# EAGLE design MyRIO_Breakout_Gamma2c (EAGLE 9.4.2)

## Sheet 1 of 2
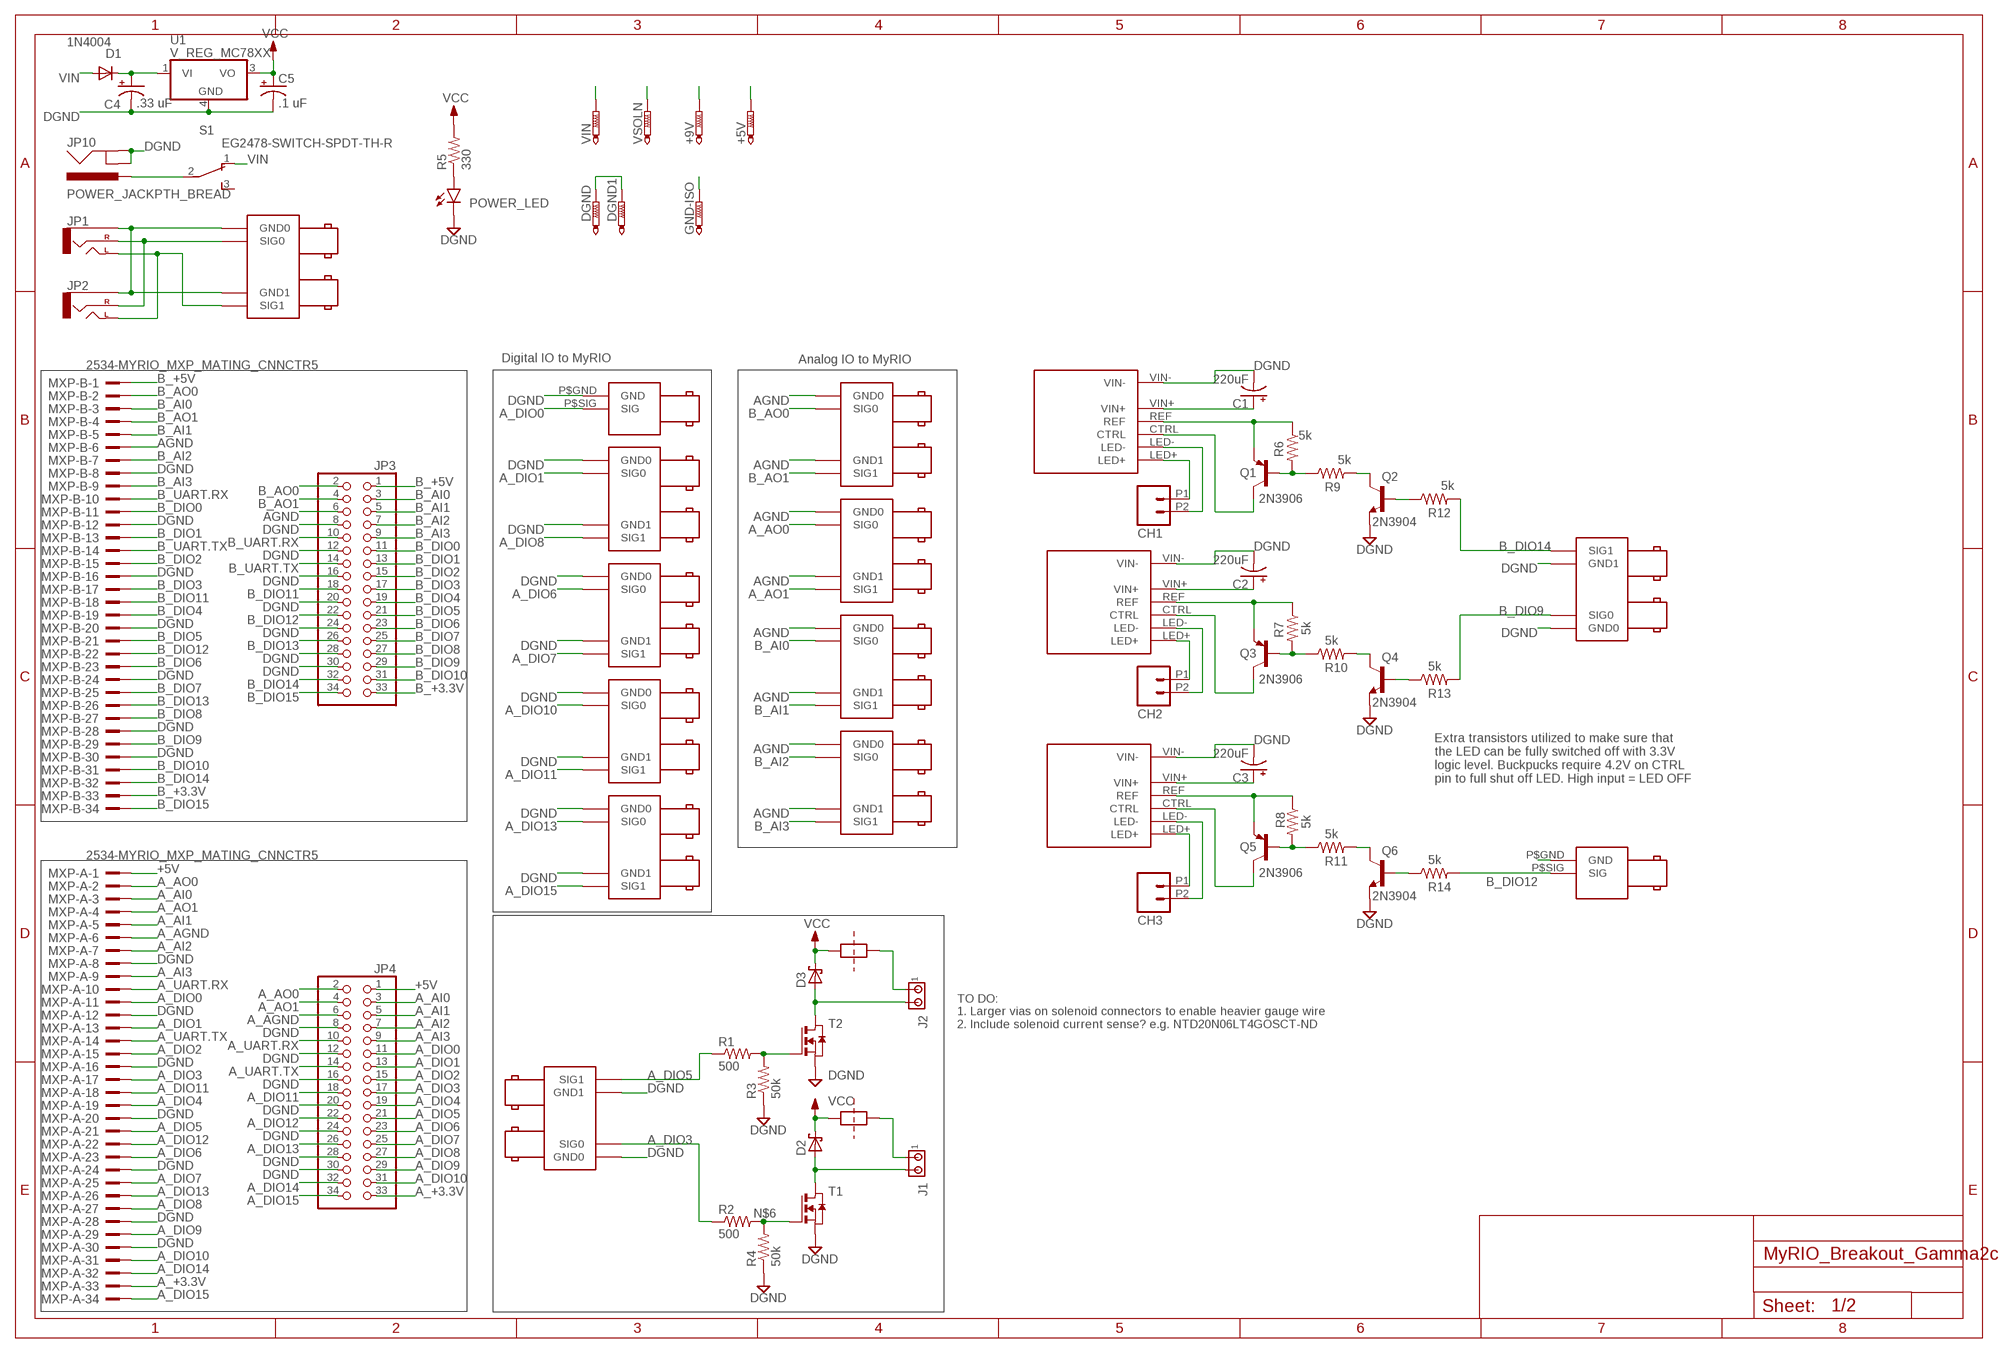
[diagram p0: schematic, sheet 1]

### Parts
+5V  PTR1PAD1-13Y  [P1-13Y]
+9V  PTR1PAD1-13Y  [P1-13Y]
AAO_0,1  BNC_RIGHT_ANGLE_DOUBLE  [BNC_RIGHT_ANGLE_DOUBLE]
ACTV_REC  BNC_RIGHT_ANGLE  [BNC_RIGHT_ANGLE]
AUDIO  BNC_RIGHT_ANGLE_DOUBLE  [BNC_RIGHT_ANGLE_DOUBLE]
BAI_0,1  BNC_RIGHT_ANGLE_DOUBLE  [BNC_RIGHT_ANGLE_DOUBLE]
BAI_2,3  BNC_RIGHT_ANGLE_DOUBLE  [BNC_RIGHT_ANGLE_DOUBLE]
BAO_0,1  BNC_RIGHT_ANGLE_DOUBLE  [BNC_RIGHT_ANGLE_DOUBLE]
BUCKPUCK1  BUCKPUCK-350-I  [BUCKPUCK_I]
BUCKPUCK2  BUCKPUCK-350-I  [BUCKPUCK_I]
BUCKPUCK3  BUCKPUCK-350-I  [BUCKPUCK_I]
C1  220uF  CPOL-USE5-10.5  [E5-10,5]
C2  220uF  CPOL-USE5-10.5  [E5-10,5]
C3  220uF  CPOL-USE5-10.5  [E5-10,5]
C4  .33 uF  CPOL-USE2.5-5  [E2,5-5]
C5  .1 uF  CPOL-USE2.5-5  [E2,5-5]
CAMERA  BNC_RIGHT_ANGLE_DOUBLE  [BNC_RIGHT_ANGLE_DOUBLE]
CH1  M022.54MM_SCREWTERM  [1X02_2.54_SCREWTERM]
CH2  M022.54MM_SCREWTERM  [1X02_2.54_SCREWTERM]
CH3  M022.54MM_SCREWTERM  [1X02_2.54_SCREWTERM]
D1  1N4004  [DO41-10]
D2  SCHOTTKY-DIODE  [DIODE_SMB]
D3  SCHOTTKY-DIODE  [DIODE_SMB]
D_FREE1_2  BNC_RIGHT_ANGLE_DOUBLE  [BNC_RIGHT_ANGLE_DOUBLE]
D_FREE3_4  BNC_RIGHT_ANGLE_DOUBLE  [BNC_RIGHT_ANGLE_DOUBLE]
DGND  PTR1PAD1-13Y  [P1-13Y]
DGND1  PTR1PAD1-13Y  [P1-13Y]
GND-ISO  PTR1PAD1-13Y  [P1-13Y]
J1  MTA02-100  [10X02MTA]
J2  MTA02-100  [10X02MTA]
JP1  AUDIO-JACKPTH  [AUDIO-JACK]
JP2  AUDIO-JACKPTH  [AUDIO-JACK]
JP3  PINHD-2X17  [2X17]
JP4  PINHD-2X17  [2X17]
JP5  CUTABLE_RESISTOR_JUMPER1206  [1206_WITH_TRACE]
JP6  CUTABLE_RESISTOR_JUMPER1206  [1206_WITH_TRACE]
JP10  POWER_JACKPTH_BREAD  [POWER_JACK_PTH_BREAD]
LED_CUE_3  BNC_RIGHT_ANGLE  [BNC_RIGHT_ANGLE]
LED_MASK_1,2  BNC_RIGHT_ANGLE_DOUBLE  [BNC_RIGHT_ANGLE_DOUBLE]
MXP-A  2534-MYRIO_MXP_MATING_CNNCTR5  [PAK100/2500-5-34-MXP_CONNCTR]
MXP-B  2534-MYRIO_MXP_MATING_CNNCTR5  [PAK100/2500-5-34-MXP_CONNCTR]
POWER_LED  LED3MM  [LED3MM]
Q1  2N3906  MMBT3906LT1-PNP-SOT23-BEC  [SOT23-BEC]
Q2  2N3904  MMBT3904LT1-NPN-SOT23-BEC  [SOT23-BEC]
Q3  2N3906  MMBT3906LT1-PNP-SOT23-BEC  [SOT23-BEC]
Q4  2N3904  MMBT3904LT1-NPN-SOT23-BEC  [SOT23-BEC]
Q5  2N3906  MMBT3906LT1-PNP-SOT23-BEC  [SOT23-BEC]
Q6  2N3904  MMBT3904LT1-NPN-SOT23-BEC  [SOT23-BEC]
R1  500  R-US_M1206  [M1206]
R2  500  R-US_M1206  [M1206]
R3  50k  R-US_M1206  [M1206]
R4  50k  R-US_M1206  [M1206]
R5  330  R-US_0207/10  [0207/10]
R6  5k  RESISTOR_SM0805S  [0805S]
R7  5k  RESISTOR_SM0805S  [0805S]
R8  5k  RESISTOR_SM0805S  [0805S]
R9  5k  RESISTOR_SM0805S  [0805S]
R10  5k  RESISTOR_SM0805S  [0805S]
R11  5k  RESISTOR_SM0805S  [0805S]
R12  5k  RESISTOR_SM0805S  [0805S]
R13  5k  RESISTOR_SM0805S  [0805S]
R14  5k  RESISTOR_SM0805S  [0805S]
S1  EG2478-SWITCH-SPDT-TH-R  [ESWITCH_500-SSP1M6]
SHUTTER  BNC_RIGHT_ANGLE_DOUBLE  [BNC_RIGHT_ANGLE_DOUBLE]
SLN  BNC_RIGHT_ANGLE_DOUBLE  [BNC_RIGHT_ANGLE_DOUBLE]
T1  NMOSSOT223  [SOT223]
T2  NMOSSOT223  [SOT223]
U1  V_REG_MC78XX  [DPAK]
VIN  PTR1PAD1-13Y  [P1-13Y]
VSOLN  PTR1PAD1-13Y  [P1-13Y]

### Nets
+5V: +5V.TP JP4.1 MXP-A.1 ; also sheet 2
+9V: +9V.TP ; also sheet 2
A_+3.3V: JP4.33 MXP-A.33
A_AGND: JP4.6 MXP-A.6
A_AI0: JP4.3 MXP-A.3
A_AI1: JP4.5 MXP-A.5
A_AI2: JP4.7 MXP-A.7
A_AI3: JP4.9 MXP-A.9
A_AO0: AAO_0,1.P$SIG0(SIG0) JP4.2 MXP-A.2
A_AO1: AAO_0,1.P$SIG1(SIG1) JP4.4 MXP-A.4
A_DIO0: ACTV_REC.P$SIG(SIG) JP4.11 MXP-A.11
A_DIO1: CAMERA.P$SIG0(SIG0) JP4.13 MXP-A.13
A_DIO2: JP4.15 MXP-A.15 ; also sheet 2
A_DIO3: JP4.17 MXP-A.17 R2.1 SLN.P$SIG0(SIG0)
A_DIO4: JP4.19 MXP-A.19 ; also sheet 2
A_DIO5: JP4.21 MXP-A.21 R1.1 SLN.P$SIG1(SIG1)
A_DIO6: JP4.23 MXP-A.23 SHUTTER.P$SIG0(SIG0)
A_DIO7: JP4.25 MXP-A.25 SHUTTER.P$SIG1(SIG1)
A_DIO8: CAMERA.P$SIG1(SIG1) JP4.27 MXP-A.27
A_DIO9: JP4.29 MXP-A.29
A_DIO10: D_FREE1_2.P$SIG0(SIG0) JP4.31 MXP-A.31
A_DIO11: D_FREE1_2.P$SIG1(SIG1) JP4.18 MXP-A.18
A_DIO12: JP4.22 MXP-A.22
A_DIO13: D_FREE3_4.P$SIG0(SIG0) JP4.26 MXP-A.26
A_DIO14: JP4.32 MXP-A.32
A_DIO15: D_FREE3_4.P$SIG1(SIG1) JP4.34 MXP-A.34
A_UART.RX: JP4.10 MXP-A.10
A_UART.TX: JP4.14 MXP-A.14
AGND: AAO_0,1.P$GND0(GND0) AAO_0,1.P$GND1(GND1) BAI_0,1.P$GND0(GND0) BAI_0,1.P$GND1(GND1) BAI_2,3.P$GND0(GND0) BAI_2,3.P$GND1(GND1) BAO_0,1.P$GND0(GND0) BAO_0,1.P$GND1(GND1) JP3.6 MXP-B.6 ; also sheet 2
B_+3.3V: JP3.33 MXP-B.33
B_+5V: JP3.1 MXP-B.1
B_AI0: BAI_0,1.P$SIG0(SIG0) JP3.3 MXP-B.3
B_AI1: BAI_0,1.P$SIG1(SIG1) JP3.5 MXP-B.5
B_AI2: BAI_2,3.P$SIG0(SIG0) JP3.7 MXP-B.7
B_AI3: BAI_2,3.P$SIG1(SIG1) JP3.9 MXP-B.9
B_AO0: BAO_0,1.P$SIG0(SIG0) JP3.2 MXP-B.2
B_AO1: BAO_0,1.P$SIG1(SIG1) JP3.4 MXP-B.4
B_DIO0: JP3.11 MXP-B.11
B_DIO1: JP3.13 MXP-B.13
B_DIO2: JP3.15 MXP-B.15
B_DIO3: JP3.17 MXP-B.17
B_DIO4: JP3.19 MXP-B.19
B_DIO5: JP3.21 MXP-B.21
B_DIO6: JP3.23 MXP-B.23
B_DIO7: JP3.25 MXP-B.25
B_DIO8: JP3.27 MXP-B.27
B_DIO9: JP3.29 LED_MASK_1,2.P$SIG0(SIG0) MXP-B.29 R13.2
B_DIO10: JP3.31 MXP-B.31
B_DIO11: JP3.18 MXP-B.18
B_DIO12: JP3.22 LED_CUE_3.P$SIG(SIG) MXP-B.22 R14.2
B_DIO13: JP3.26 MXP-B.26
B_DIO14: JP3.32 LED_MASK_1,2.P$SIG1(SIG1) MXP-B.32 R12.2
B_DIO15: JP3.34 MXP-B.34
B_UART.RX: JP3.10 MXP-B.10
B_UART.TX: JP3.14 MXP-B.14
BCKPCK_CTRL2: Q4.C R10.2
BCKPCK_CTRL3: Q6.C R11.2
CTRL1: BUCKPUCK1.CTRL Q1.C
CTRL2: BUCKPUCK2.CTRL Q3.C
CTRL3: BUCKPUCK3.CTRL Q5.C
DGND: ACTV_REC.P$GND(GND) BUCKPUCK1.LED- BUCKPUCK1.VIN- BUCKPUCK2.LED- BUCKPUCK2.VIN- BUCKPUCK3.LED- BUCKPUCK3.VIN- C1.- C2.- C3.- C4.- C5.- CAMERA.P$GND0(GND0) CAMERA.P$GND1(GND1) CH1.P2 CH2.P2 CH3.P2 D_FREE1_2.P$GND0(GND0) D_FREE1_2.P$GND1(GND1) D_FREE3_4.P$GND0(GND0) D_FREE3_4.P$GND1(GND1) DGND1.TP DGND.TP JP3.8 JP3.12 JP3.16 JP3.20 JP3.24 JP3.28 JP3.30 JP4.8 JP4.12 JP4.16 JP4.20 JP4.24 JP4.28 JP4.30 JP10.GND JP10.GNDBREAK LED_CUE_3.P$GND(GND) LED_MASK_1,2.P$GND0(GND0) LED_MASK_1,2.P$GND1(GND1) MXP-A.8 MXP-A.12 MXP-A.16 MXP-A.20 MXP-A.24 MXP-A.28 MXP-A.30 MXP-B.8 MXP-B.12 MXP-B.16 MXP-B.20 MXP-B.24 MXP-B.28 MXP-B.30 POWER_LED.K(C) Q2.E Q4.E Q6.E R3.1 R4.1 SHUTTER.P$GND0(GND0) SHUTTER.P$GND1(GND1) SLN.P$GND0(GND0) SLN.P$GND1(GND1) T1.3(S) T2.3(S) U1.4(GND) ; also sheet 2
GND-ISO: GND-ISO.TP ; also sheet 2
LED1+: BUCKPUCK1.LED+ CH1.P1
LED2+: BUCKPUCK2.LED+ CH2.P1
LED3+: BUCKPUCK3.LED+ CH3.P1
N$2: R1.2 R3.2 T2.1(G)
N$3: AUDIO.P$GND0(GND0) AUDIO.P$GND1(GND1) JP1.SLEEVE JP2.SLEEVE
N$4: AUDIO.P$SIG0(SIG0) JP1.RING(RIGHT) JP2.RING(RIGHT)
N$5: AUDIO.P$SIG1(SIG1) JP1.TIP(LEFT) JP2.TIP(LEFT)
N$6: R2.2 R4.2 T1.1(G)
N$11: BUCKPUCK3.REF Q5.E R8.1
N$13: POWER_LED.A R5.1
N$15: Q5.B R8.2 R11.1
N$16: BUCKPUCK1.VIN+ BUCKPUCK2.VIN+ BUCKPUCK3.VIN+ C1.+ C2.+ C3.+ C4.+ D1.C U1.1(VI) VIN.TP
N$22: BUCKPUCK1.REF Q1.E R6.1
N$24: BUCKPUCK2.REF Q3.E R7.1
N$27: Q6.B R14.1
N$28: Q4.B R13.1
N$29: Q1.B R6.2 R9.1
N$30: Q2.B R12.1
N$32: J1.1 JP6.2
N$33: Q3.B R7.2 R10.1
N$36: JP10.PWR S1.2
N$37: J2.1 JP5.2
N$42: Q2.C R9.2
VCC: C5.+ D2.C(A) D3.C(A) JP5.1 JP6.1 R5.2 U1.3(VO) VSOLN.TP
VIN: D1.A S1.1
VOUT-1: D2.A(C) J1.2 T1.2(D) T1.4(D)
VOUT-2: D3.A(C) J2.2 T2.2(D) T2.4(D)
Unconnected: S1.3

### Notes on the sheet
- Digital IO to MyRIO | Analog IO to MyRIO
- Extra transistors utilized to make sure that
  the LED can be fully switched off with 3.3V
  logic level. Buckpucks require 4.2V on CTRL
  pin to full shut off LED. High input = LED OFF
- TO DO:
  1. Larger vias on solenoid connectors to enable heavier gauge wire
  2. Include solenoid current sense? e.g. NTD20N06LT4GOSCT-ND

## Sheet 2 of 2
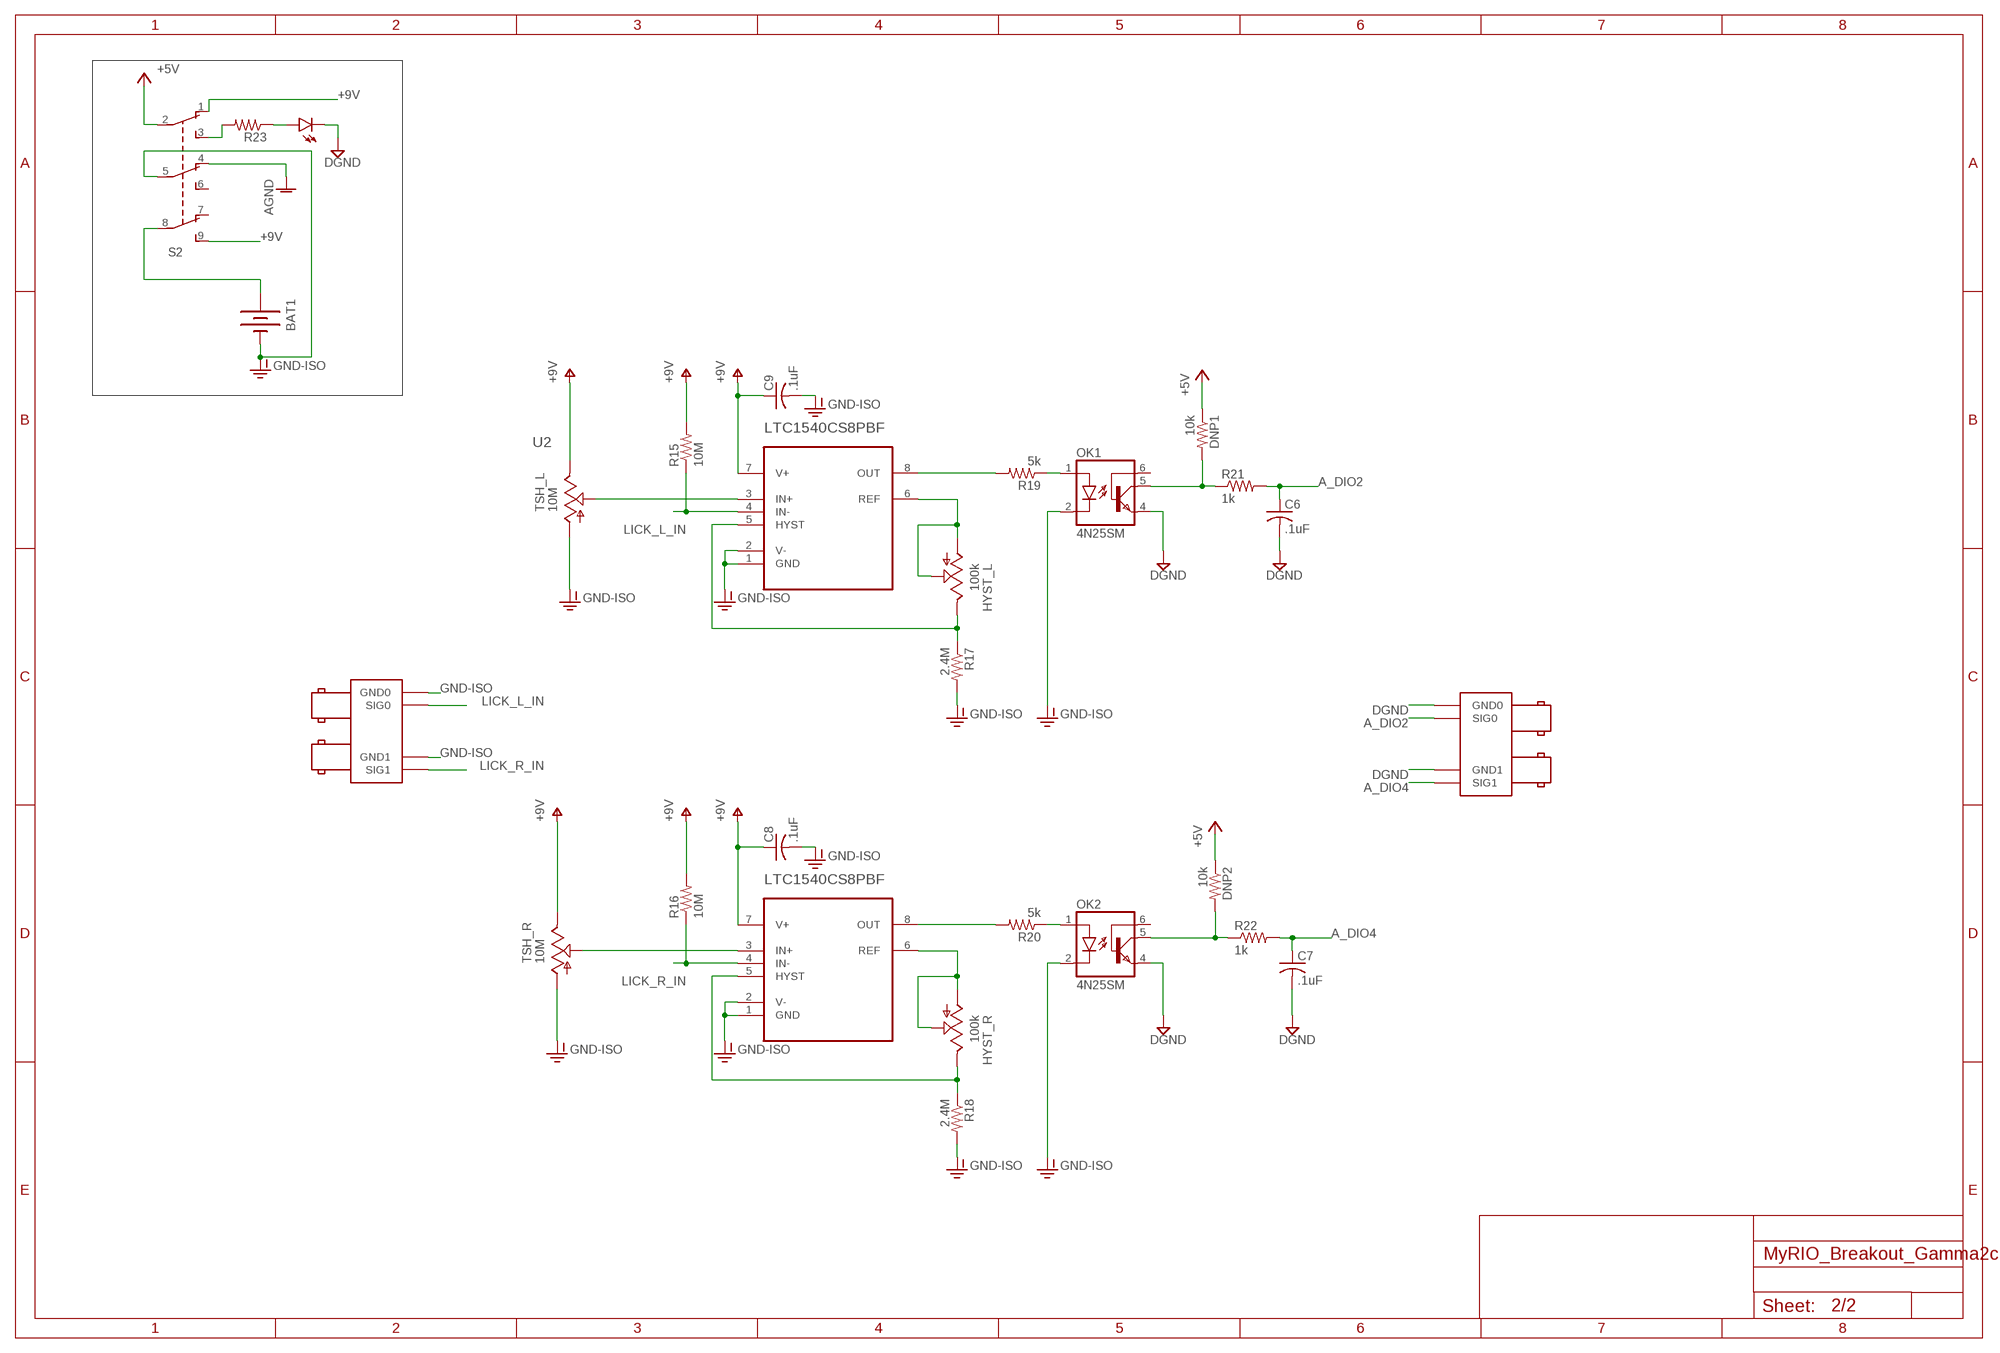
[diagram p1: schematic, sheet 2]

### Parts
BAT1  BATTERY9V  [BATTCON_9V]
C6  .1uF  C-USC0805  [C0805]
C7  .1uF  C-USC0805  [C0805]
C8  .1uF  C-USC0805  [C0805]
C9  .1uF  C-USC0805  [C0805]
DNP1  10k  R-US_M0805  [M0805]
DNP2  10k  R-US_M0805  [M0805]
HYST_L  100k  TRIM_US-B25P  [B25P]
HYST_R  100k  TRIM_US-B25P  [B25P]
ISOLATED  LED3MM  [LED3MM]
LICK  BNC_RIGHT_ANGLE_DOUBLE  [BNC_RIGHT_ANGLE_DOUBLE]
LICK_INPUTS  BNC_RIGHT_ANGLE_DOUBLE  [BNC_RIGHT_ANGLE_DOUBLE]
OK1  4N25SM  [DIL6-SMD]
OK2  4N25SM  [DIL6-SMD]
R15  10M  R-US_M0805  [M0805]
R16  10M  R-US_M0805  [M0805]
R17  2.4M  R-US_M0805  [M0805]
R18  2.4M  R-US_M0805  [M0805]
R19  5k  R-US_M0805  [M0805]
R20  5k  R-US_M0805  [M0805]
R21  1k  R-US_M0805  [M0805]
R22  1k  R-US_M0805  [M0805]
R23  330  R-US_0207/10  [0207/10]
S2  SWITCH-3PDT-TH-V  [NKK-M20-9PIN-VERTICAL]
TSH_L  10M  TRIM_US-B25P  [B25P]
TSH_R  10M  TRIM_US-B25P  [B25P]
U2  LTC1540CS8PBF  [SOIC127P600X175-8N]
U3  LTC1540CS8PBF  [SOIC127P600X175-8N]

### Nets
+5V: DNP1.1 DNP2.1 S2.2(P1) ; also sheet 1
+9V: C8.1 C9.1 R15.2 R16.2 S2.1(O1) S2.9(S3) TSH_L.E TSH_R.E U2.7(V+) U3.7(V+) ; also sheet 1
A_DIO2: C6.1 LICK.P$SIG0(SIG0) R21.2 ; also sheet 1
A_DIO4: C7.1 LICK.P$SIG1(SIG1) R22.2 ; also sheet 1
AGND: S2.4(O2) ; also sheet 1
DGND: C6.2 C7.2 ISOLATED.K(C) LICK.P$GND0(GND0) LICK.P$GND1(GND1) OK1.4(EMI) OK2.4(EMI) ; also sheet 1
GND-ISO: BAT1.- C8.2 C9.2 LICK_INPUTS.P$GND0(GND0) LICK_INPUTS.P$GND1(GND1) OK1.2(C) OK2.2(C) R17.2 R18.2 S2.5(P2) TSH_L.A TSH_R.A U2.1(GND) U2.2(V-) U3.1(GND) U3.2(V-) ; also sheet 1
LICK_L_IN: LICK_INPUTS.P$SIG0(SIG0) R15.1 U2.4(IN-)
LICK_R_IN: LICK_INPUTS.P$SIG1(SIG1) R16.1 U3.4(IN-)
N$20: BAT1.+ S2.8(P3)
N$21: ISOLATED.A R23.1
N$23: TSH_R.S U3.3(IN+)
N$25: R23.2 S2.3(S1)
N$26: OK1.1(A) R19.1
N$31: R19.2 U2.8(OUT)
N$38: DNP1.2 OK1.5(COL) R21.1
N$39: HYST_L.A HYST_L.S U2.6(REF)
N$40: HYST_L.E R17.1 U2.5(HYST)
N$46: OK2.1(A) R20.1
N$47: R20.2 U3.8(OUT)
N$48: TSH_L.S U2.3(IN+)
N$49: DNP2.2 OK2.5(COL) R22.1
N$50: HYST_R.A HYST_R.S U3.6(REF)
N$51: HYST_R.E R18.1 U3.5(HYST)
Unconnected: OK1.6(BAS) OK2.6(BAS) S2.6(S2) S2.7(O3)

## Library data of the parts
+5V +9V DGND DGND1 GND-ISO VIN VSOLN = testpad:PTR1: TEST PIN
AAO_0,1 AUDIO BAI_0,1 BAI_2,3 BAO_0,1 CAMERA D_FREE1_2 D_FREE3_4 LED_MASK_1,2 LICK LICK_INPUTS SHUTTER SLN = Pavel_Connectors:BNC_RIGHT_ANGLE_DOUBLE
ACTV_REC LED_CUE_3 = connectors:BNC_RIGHT_ANGLE: BNC plug, through-hole, right-angle
BAT1 = Pavel_ElectroMechanical:BATTERY: Battery Holders Various common sizes : AA, AAA, 18650 (PRT-12895), 20mm coin cell and 12mm coin cell. 20MM_4LEGS, BATT-10373 9V Digikey BH9v-PC-ND
BUCKPUCK1-BUCKPUCK3 = Pavel-PowerIC:BUCKPUCK-*-?
C1-C5 = adafruit:CPOL-US: POLARIZED CAPACITOR, American symbol
C6 = adafruit:C-US: CAPACITOR, American symbol
C7-C9 = adafruit:C-US: CAPACITOR, American symbol; SPICEPREFIX: C
CH1-CH3 = SparkFun-Connectors:M02: Standard 2-pin 0.1" header. Use with - straight break away headers ( PRT-00116) - right angle break away headers (PRT-00553) - swiss pins (PRT-00743) - machine pins (PRT-00117) - female headers (PRT-00115) Molex polarized connector foot print use with: PRT-08233 with associated crimp pins and housings. 2.54_SCREWTERM for use with PRT-10571. 3.5mm Screw Terminal footprints for PRT-08084 5mm Screw Terminal footprints for use with PRT-08432
D1 = adafruit:1N4004: DIODE General purpose 1N400x type rectifier (With bigger pads) http://www.ladyada.net/library/pcb/eaglelibrary.html
D2 D3 = eagle-ltspice:SCHOTTKY-DIODE: Schottky Diode; SPICEMODEL: NONE; SPICEPREFIX: D; SPICETYPE: diode
DNP1 R1-R5 R17 R19 R21 R23 = adafruit:R-US_: RESISTOR, American symbol
DNP2 R15 R16 R18 R20 R22 = adafruit:R-US_: RESISTOR, American symbol; SPICEPREFIX: R
HYST_L TSH_L TSH_R = pot:TRIM_US-: POTENTIOMETER
HYST_R = pot:TRIM_US-: POTENTIOMETER; SPICEPREFIX: J
ISOLATED POWER_LED = led:LED: LED OSRAM: - CHIPLED LG R971, LG N971, LY N971, LG Q971, LY Q971, LO R971, LY R971 LH N974, LH R974 LS Q976, LO Q976, LY Q976 LO Q996 - Hyper CHIPLED LW Q18S LB Q993, LB Q99A, LB R99A - SideLED LS A670, LO A670, LY A670, LG A670, LP A670 LB A673, LV A673, LT A673, LW A673 LH A674 LY A675 LS A676, LA A676, LO A676, LY A676, LW A676 LS A679, LY A679, LG A679 - Hyper Micro SIDELED® LS Y876, LA Y876, LO Y876, LY Y876 LT Y87S - SmartLED LW L88C, LW L88S LB L89C, LB L89S, LG L890 LS L89K, LO L89K, LY L89K LS L896, LA L896, LO L896, LY L896 - TOPLED LS T670, LO T670, LY T670, LG T670, LP T670 LSG T670, LSP T670, LSY T670, LOP T670, LYG T670 LG T671, LOG T671, LSG T671 LB T673, LV T673, LT T673, LW T673 LH T674 LS T676, LA T676, LO T676, LY T676, LB T676, LH T676, LSB T676, LW T676 LB T67C, LV T67C, LT T67C, LS T67K, LO T67K, LY T67K, LW E67C LS E67B, LA E67B, LO E67B, LY E67B, LB E67C, LV E67C, LT E67C LW T67C LS T679, LY T679, LG T679 LS T770, LO T770, LY T770, LG T770, LP T770 LB T773, LV T773, LT T773, LW T773 LH T774 LS E675, LA E675, LY E675, LS T675 LS T776, LA T776, LO T776, LY T776, LB T776 LHGB T686 LT T68C, LB T68C - Hyper Mini TOPLED® LB M676 - Mini TOPLED Santana® LG M470 LS M47K, LO M47K, LY M47K Source: http://www.osram.convergy.de LUXEON: - LUMILED® LXK2-PW12-R00, LXK2-PW12-S00, LXK2-PW14-U00, LXK2-PW14-V00 LXK2-PM12-R00, LXK2-PM12-S00, LXK2-PM14-U00 LXK2-PE12-Q00, LXK2-PE12-R00, LXK2-PE12-S00, LXK2-PE14-T00, LXK2-PE14-U00 LXK2-PB12-K00, LXK2-PB12-L00, LXK2-PB12-M00, LXK2-PB14-N00, LXK2-PB14-P00, LXK2-PB14-Q00 LXK2-PR12-L00, LXK2-PR12-M00, LXK2-PR14-Q00, LXK2-PR14-R00 LXK2-PD12-Q00, LXK2-PD12-R00, LXK2-PD12-S00 LXK2-PH12-R00, LXK2-PH12-S00 LXK2-PL12-P00, LXK2-PL12-Q00, LXK2-PL12-R00 Source: www.luxeon.com KINGBRIGHT: KA-3528ASYC Source: www.kingbright.com
J1 J2 = con-amp:MTA02-100: AMP connector
JP1 JP2 = SparkFun-Connectors:AUDIO-JACK: 3.5mm Audio Jack Simple 3.5mm common PCB mount audio jack. Variant PTH is our storefront SKU PRT-08032
JP3 JP4 = pinhead:PINHD-2X17: PIN HEADER
JP5 JP6 = Pavel_Passives:CUTABLE_RESISTOR_JUMPER
JP10 = SparkFun-Connectors:POWER_JACK: Power Jack Connector This is the standard 5.5mm barrel jack for power. The PTH is the most common, proven, reliable, footprint. The Slot footprint only works if the mill layer is transmitted to the PCB fab house so be warned. Here are the connectors we sell at SparkFun: DC Barrel Power Jack/Connector <https://www.sparkfun.com/products/119> (PRT-00119) DC Barrel Power Jack/Connector (SMD) <https://www.sparkfun.com/products/12748> (PRT-12748) DC Barrel Jack Adapter - Breadboard Compatible <https://www.sparkfun.com/products/10811> (PRT-10811) It is used on this SparkFun product (and many, many others): SparkFun RedBoard - Programmed with Arduino <https://www.sparkfun.com/products/12757> (DEV-12757) Also, if you need a mating power supply or connector, please check these out: Wall Adapter Power Supply - 9VDC 650mA <https://www.sparkfun.com/products/298> (TOL-00298) DC Barrel Jack Adapter - Male <https://www.sparkfun.com/products/10287> (PRT-10287); PROD_ID: PRT-10811
MXP-A MXP-B = Pavel_ElectroMechanical:2534-MYRIO_MXP_MATING_CNNCTR: 3M (TM) Pak 100 4-Wall Header Source: 3M; OC_FARNELL: 9838406; OC_NEWARK: unknown
OK1 = optocoupler:4N*?M: General Purpose 6-Pin Phototransistor Optocouplers Source: http://www.fairchildsemi.com/ds/4N/4N35-M.pdf; MF: FAIRCHILD SEMICONDUCTOR; MPN: 4N25SM; OC_FARNELL: 1021152; OC_NEWARK: 34C2020
OK2 = optocoupler:4N*?M: General Purpose 6-Pin Phototransistor Optocouplers Source: http://www.fairchildsemi.com/ds/4N/4N35-M.pdf; MF: FAIRCHILD SEMICONDUCTOR; MPN: 4N25SM; OC_FARNELL: 1021152; OC_NEWARK: 34C2020; SPICEPREFIX: X
Q1 Q3 Q5 = transistor:*-PNP-: PNP Transistror
Q2 Q4 Q6 = transistor-neu-to92:*-NPN-: NPN Transistror
R6-R14 = SteveS:RESISTOR_SM
S1 = Pavel_ElectroMechanical:EG2478-SWITCH-SPDT-TH-R: E-Switch 500 series right-angle slide SPDT Part EG2478-ND<a=https://www.digikey.com/product-detail/en/e-switch/500SSP1S1M6QEA/EG2478-ND/378947>
S2 = Pavel_ElectroMechanical:SWITCH-3PDT-TH-V: 3PDT 9 pin footswitch SF17020F-0302-21R-L Source: 3PDT.jpg
T1 T2 = zetex:NMOSSOT223: MOS FET; OC_FARNELL: unknown; OC_NEWARK: unknown
U1 = Pavel-PowerIC:V_REG_MC78XX: DigiKey MC7815BD2TR4GOSDKR-ND TO-263-3, D2Pak, TO-263AB http://www.digikey.com/product-detail/en/MC7815BD2TR4G/MC7815BD2TR4GOSDKR-ND/3462629
U2 = LTC1540CS8PBF:LTC1540CS8PBF: 12-Bit Rail-to-Rail Micropower DACs; AVAILABILITY: Unavailable; DESCRIPTION: Comparator Single ±5.5 Volt 11 Volt 8-Pin SOIC N; MF: Linear Technology/Analog; MP: LTC1540CS8#PBF; PACKAGE: SO-8 Linear Technology; PRICE: None
U3 = LTC1540CS8PBF:LTC1540CS8PBF: 12-Bit Rail-to-Rail Micropower DACs; AVAILABILITY: Unavailable; DESCRIPTION: Comparator Single ±5.5 Volt 11 Volt 8-Pin SOIC N; MF: Linear Technology/Analog; MP: LTC1540CS8#PBF; PACKAGE: SO-8 Linear Technology; PRICE: None; SPICEPREFIX: X

## Net classes
1 power: width 0.508 mm

## Board
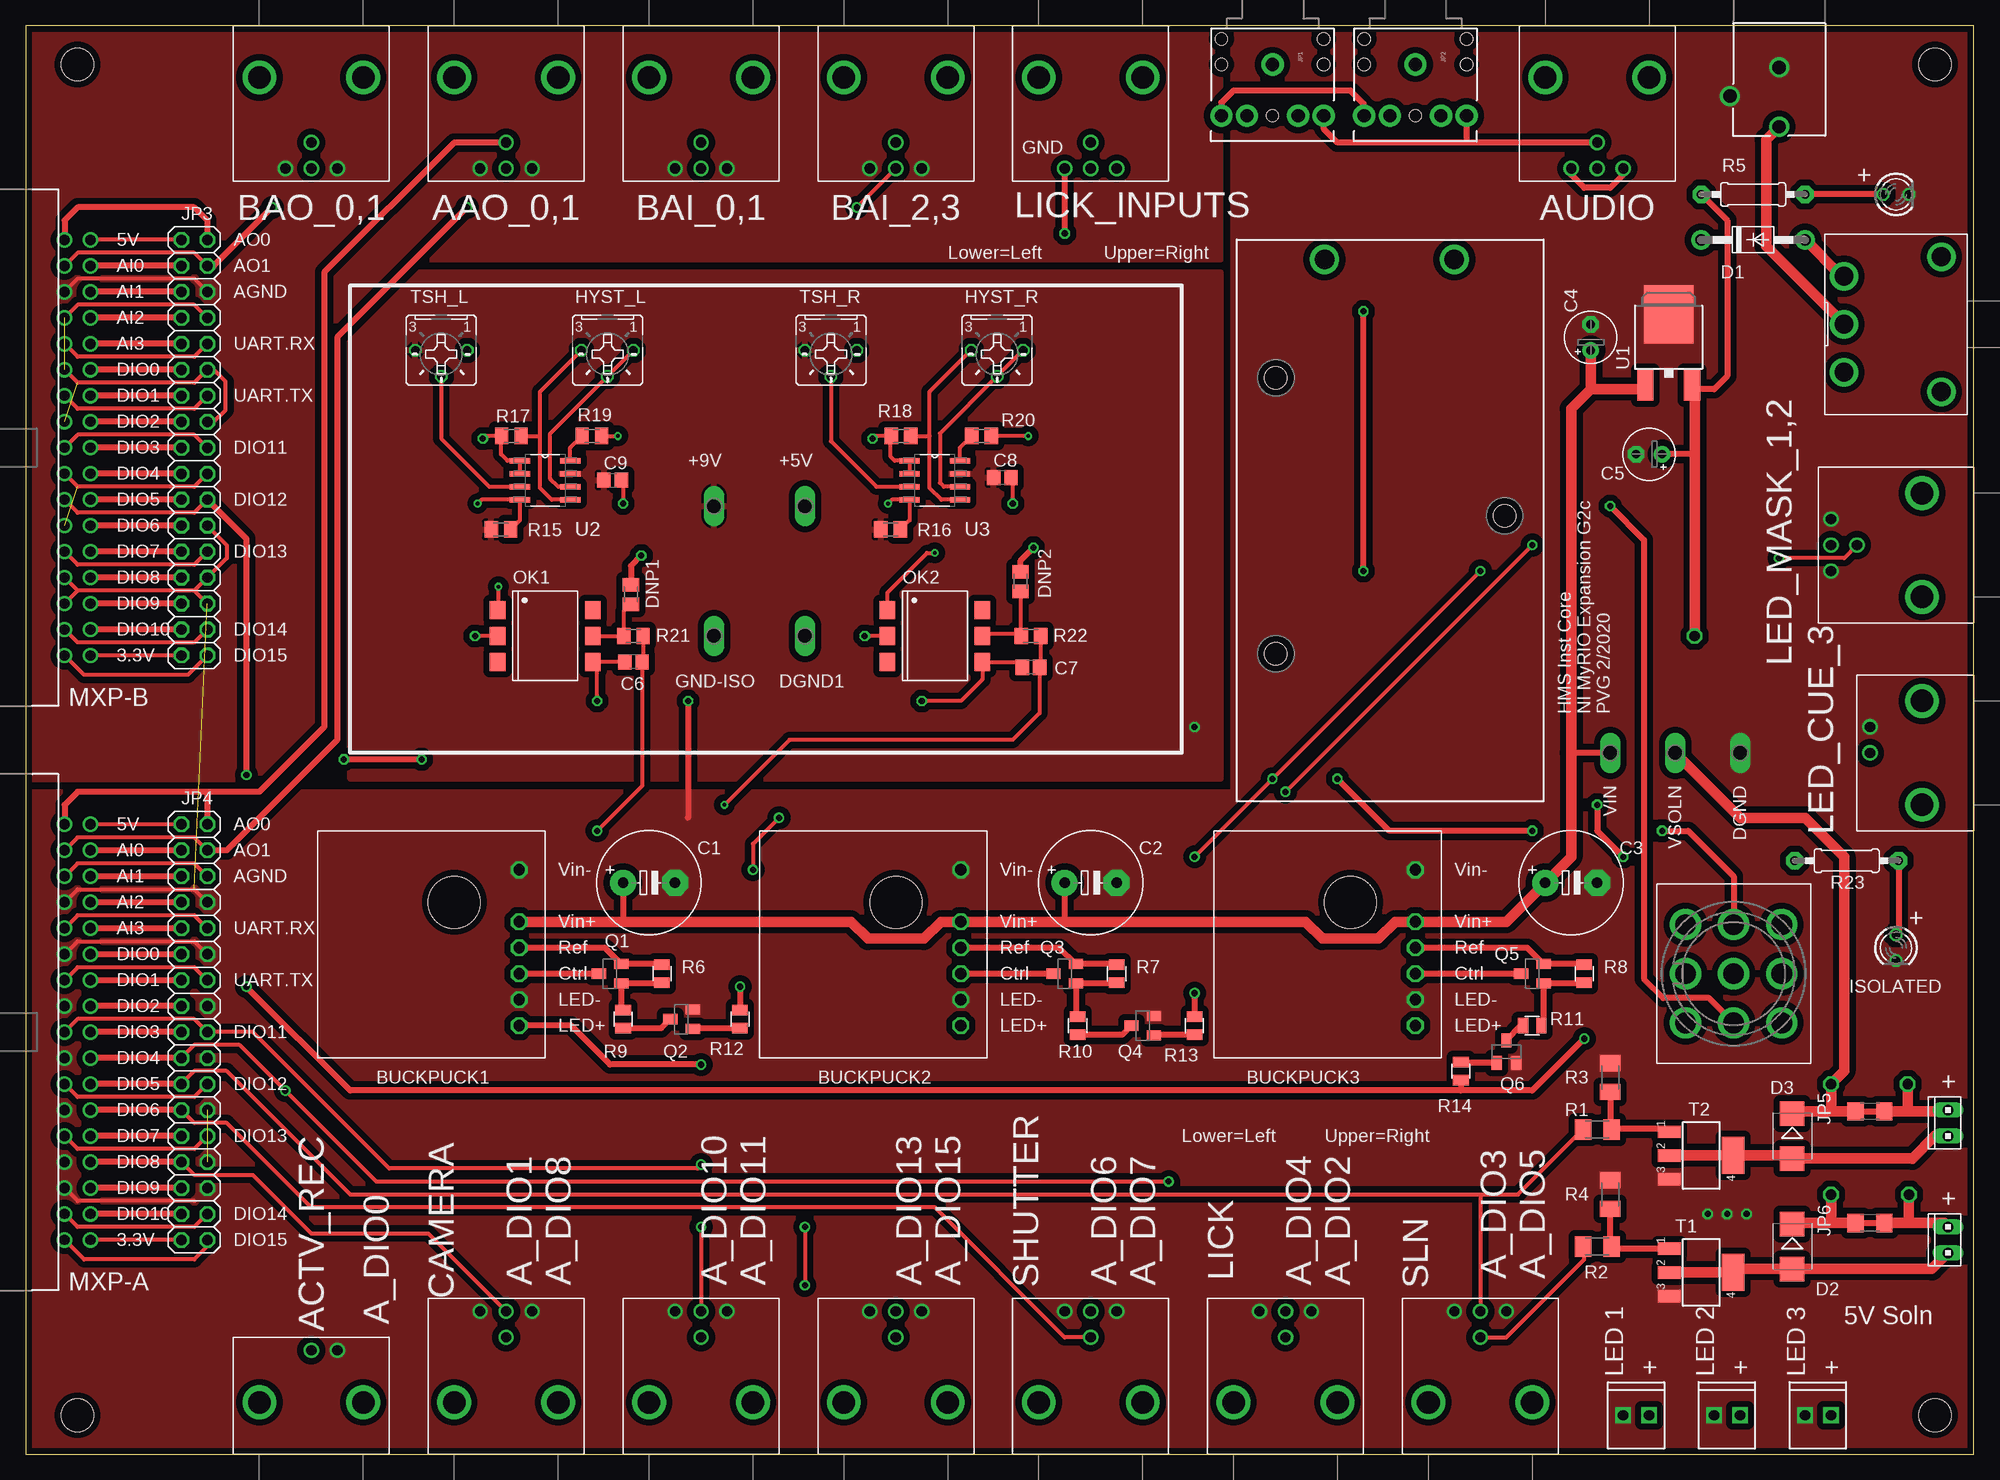
[diagram p2: board, top side]
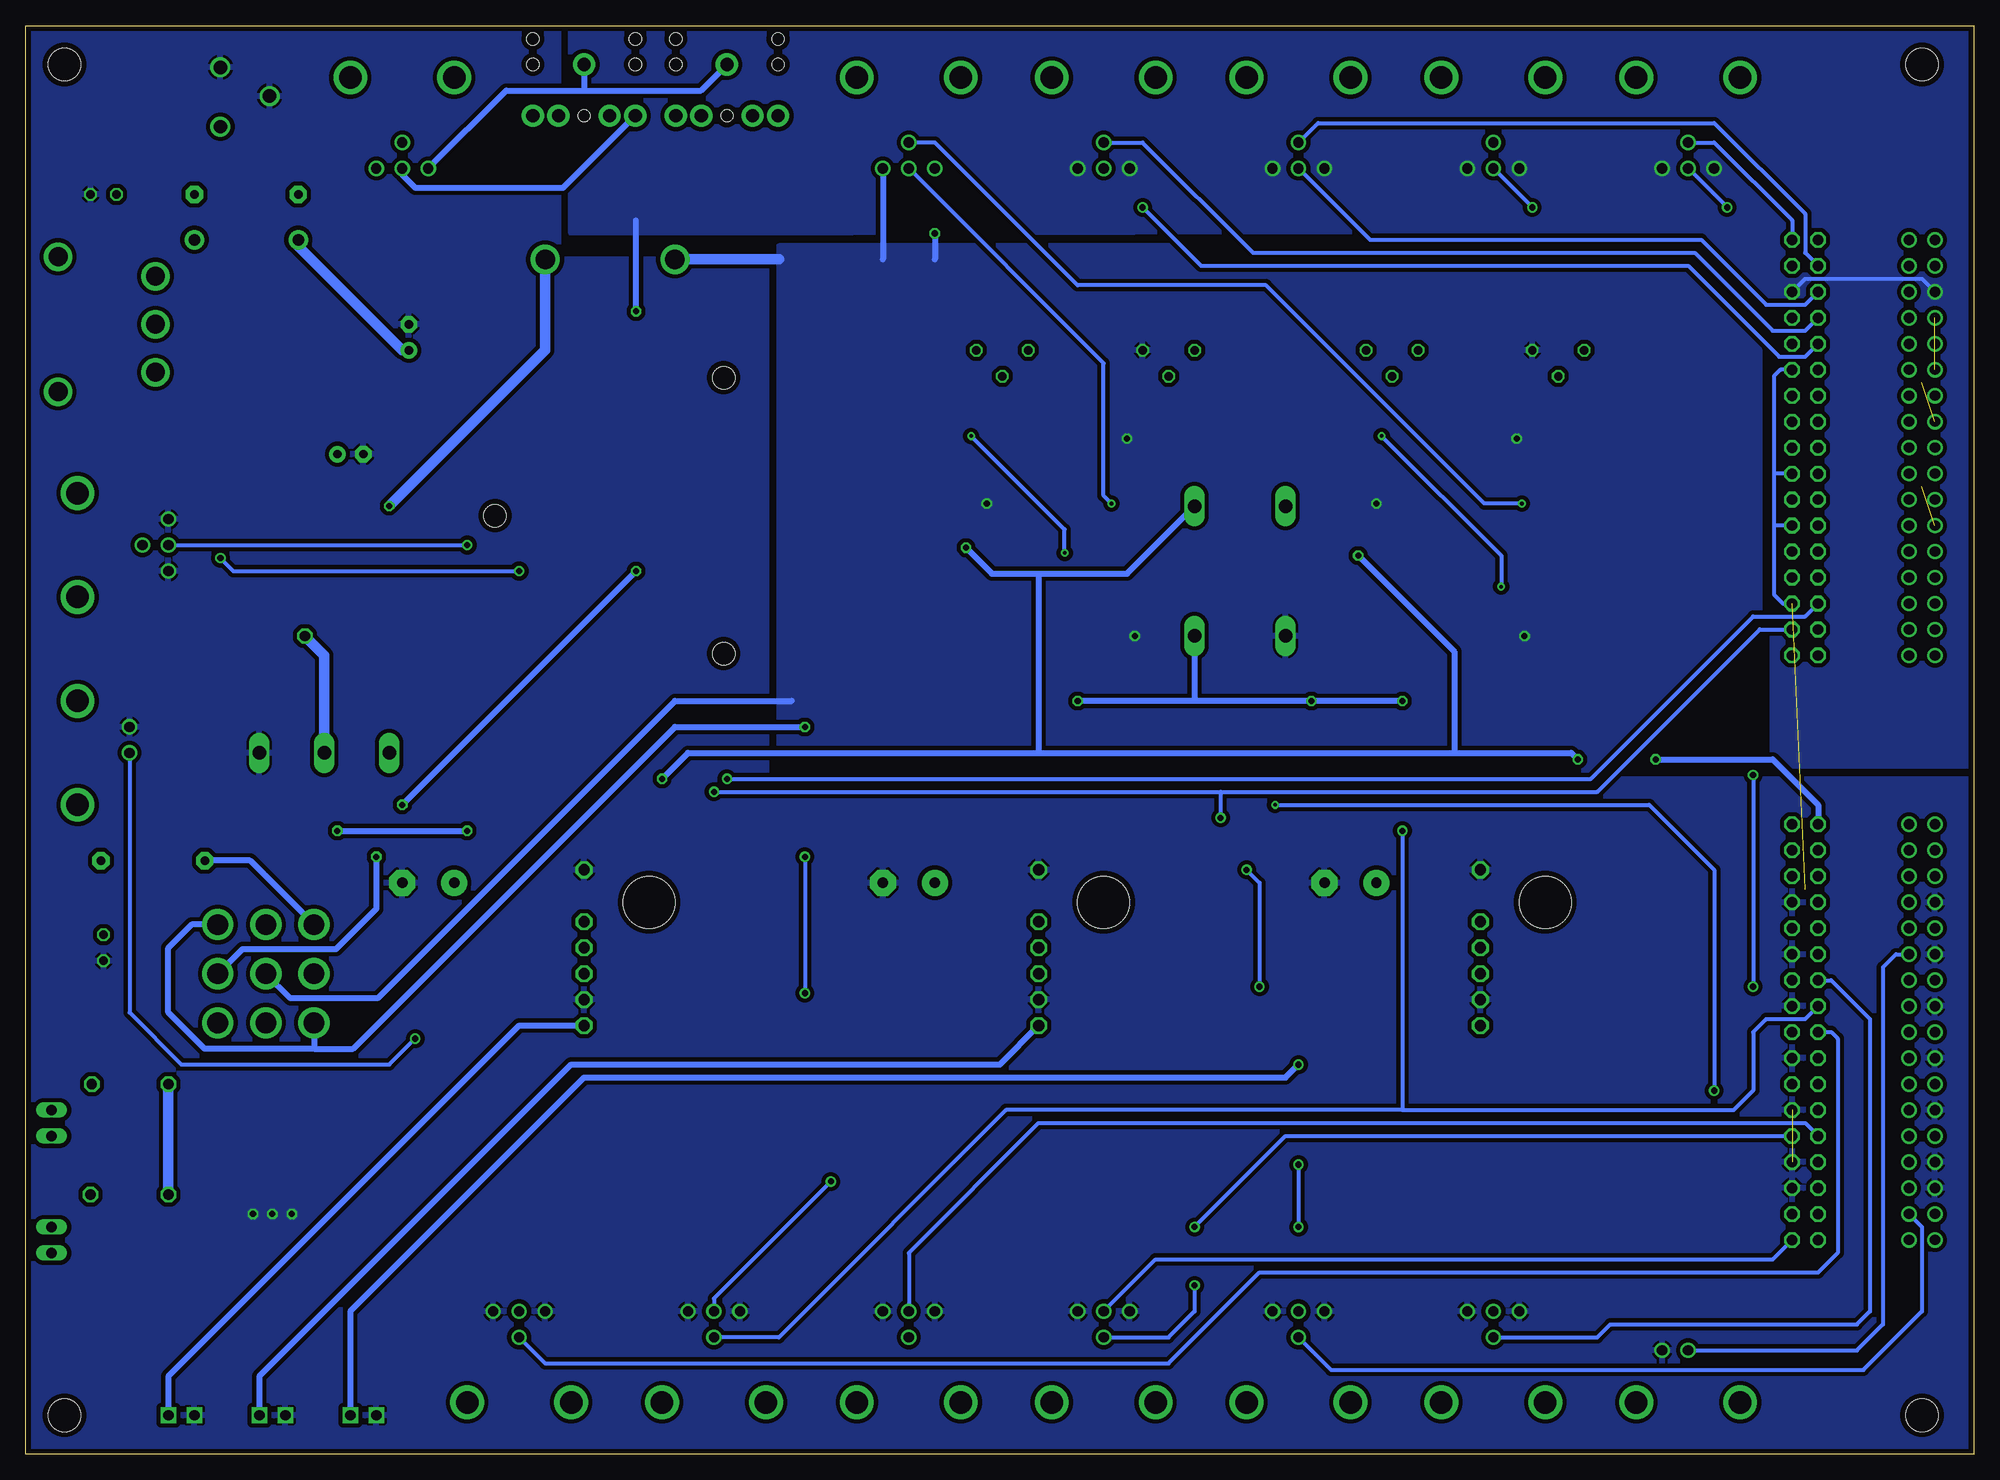
[diagram p3: board, bottom side, seen from below]

Size 190.5 x 139.7 mm. Coordinates in mm from the lower left corner, seen from the top.
Outline: 0,0 190.48,0 190.5,139.7 0,139.7 0,0
Copper layers (1*16): Top 0.0178mm / dielectric 59mil / Bottom 0.0178mm
Design rules "SSC-EAGLE-2Lyr_v1.0.0.3": minimum track width 6mil, minimum drill 14mil, track to track 6mil, track to pad 6mil, pad to pad 6mil, via to via 6mil, smd to smd 6mil, copper to edge 20mil, drill to drill 16mil, minimum pad ring 8mil, minimum via ring 8mil, stop-mask expansion 3mil, vias tented up to drill 0mil, thermal gap 10mil
Holes 3.2 mm at 5.08,3.81 186.69,3.81 186.69,135.89 5.08,135.89

### Footprints (pad centres in the part's own frame; a part is rotated, then mirrored left to right if it is on the bottom)
P1-13Y = drill 1.321 pad 1.905 long: TP 0,0
BNC_RIGHT_ANGLE_DOUBLE = drill 2.2: P$1 0,-5.08; P$2 0,5.08 | drill 1: P$GND0 8.89,-2.54; P$GND1 8.89,2.54; P$SIG0 6.35,0; P$SIG1 8.89,0
BNC_RIGHT_ANGLE = drill 2.2: P$1 -5.08,-6.35; P$2 5.08,-6.35 | drill 1: P$GND -2.54,-11.43; P$SIG 0,-11.43
BATTCON_9V = drill 1.905: + 0,-12.7; - 0,0 | hole 2.2: -11.582,4.75; -38.557,4.75; -25.07,-17.602
BUCKPUCK_I = drill 1.1 octagon: CTRL -8.89,2.54; LED+ -8.89,7.62; LED- -8.89,5.08; REF -8.89,0; VIN+ -8.89,-2.54; VIN- -8.89,-7.62 | hole 5.08: -2.54,-4.445
E5-10,5 = drill 1.016 pad 2.54: + -2.54,0 | drill 1.016 pad 2.54 octagon: - 2.54,0
E2,5-5 = drill 0.813 pad 1.6: + -1.27,0 | drill 0.813 pad 1.6 octagon: - 1.27,0
C0805 = smd 1.3 x 1.5: 1 -0.85,0; 2 0.85,0
1X02_2.54_SCREWTERM = drill 1.016 square: P1 2.54,0; P2 0,0
DO41-10 = drill 1.118 pad 1.93: A 5.08,0; C -5.08,0
DIODE_SMB = smd 2.4 x 2.4: A 2.2,0; C -2.2,0
M0805 = smd 1.3 x 1.6: 1 -0.95,0; 2 0.95,0
B25P = drill 0.813 octagon: A -2.54,0; E 2.54,0; S 0,2.54
LED3MM = drill 0.813 octagon: A -1.27,0; K 1.27,0
10X02MTA = drill 1.016 long: 1 1.27,0; 2 -1.27,0
AUDIO-JACK = drill 1.3 pad 2.184: RING 5,5; RSH 5,2.5; SLEEVE 0,0; TIP 5,-5; TSH 5,-2.5 | hole 1.2: 0,5; -2.5,5; -2.5,-5; 0,-5; 5,0
2X17 = drill 1.016 octagon: 1 -20.32,-1.27; 2 -20.32,1.27; 3 -17.78,-1.27; 4 -17.78,1.27; 5 -15.24,-1.27; 6 -15.24,1.27; 7 -12.7,-1.27; 8 -12.7,1.27; 9 -10.16,-1.27; 10 -10.16,1.27; 11 -7.62,-1.27; 12 -7.62,1.27; 13 -5.08,-1.27; 14 -5.08,1.27; 15 -2.54,-1.27; 16 -2.54,1.27; 17 0,-1.27; 18 0,1.27; 19 2.54,-1.27; 20 2.54,1.27; 21 5.08,-1.27; 22 5.08,1.27; 23 7.62,-1.27; 24 7.62,1.27; 25 10.16,-1.27; 26 10.16,1.27; 27 12.7,-1.27; 28 12.7,1.27; 29 15.24,-1.27; 30 15.24,1.27; 31 17.78,-1.27; 32 17.78,1.27; 33 20.32,-1.27; 34 20.32,1.27
1206_WITH_TRACE = smd 1.8 x 1.6: 1 0,1.4; 2 0,-1.4
POWER_JACK_PTH_BREAD = drill 1.3: GND 0,7.9; GNDBREAK 4.8,10.7; PWR 0,13.7
PAK100/2500-5-34-MXP_CONNCTR = drill 1 pad 1.422: 1 20.32,-1.27; 2 20.32,1.27; 3 17.78,-1.27; 4 17.78,1.27; 5 15.24,-1.27; 6 15.24,1.27; 7 12.7,-1.27; 8 12.7,1.27; 9 10.16,-1.27; 10 10.16,1.27; 11 7.62,-1.27; 12 7.62,1.27; 13 5.08,-1.27; 14 5.08,1.27; 15 2.54,-1.27; 16 2.54,1.27; 17 0,-1.27; 18 0,1.27; 19 -2.54,-1.27; 20 -2.54,1.27; 21 -5.08,-1.27; 22 -5.08,1.27; 23 -7.62,-1.27; 24 -7.62,1.27; 25 -10.16,-1.27; 26 -10.16,1.27; 27 -12.7,-1.27; 28 -12.7,1.27; 29 -15.24,-1.27; 30 -15.24,1.27; 31 -17.78,-1.27; 32 -17.78,1.27; 33 -20.32,-1.27; 34 -20.32,1.27
DIL6-SMD = smd 1.78 x 1.52: 1 -2.54,-4.645; 2 0,-4.645; 3 2.54,-4.645; 4 2.54,4.645; 5 0,4.645; 6 -2.54,4.645
SOT23-BEC = smd 1 x 1.4: B -0.95,-1.1; C 0,1.1; E 0.95,-1.1
M1206 = smd 1.6 x 2: 1 -1.4,0; 2 1.4,0
0207/10 = drill 0.813 pad 1.676 octagon: 1 -5.08,0; 2 5.08,0
0805S = smd 1.016 x 1.524: 1 -0.889,0; 2 0.889,0
ESWITCH_500-SSP1M6 = drill 1.854: 1 -4.699,-5.08; 2 0,-5.08; 3 4.699,-5.08; MT1 -6.604,4.445; MT2 6.604,4.445
NKK-M20-9PIN-VERTICAL = drill 2.032: 1 -4.801,4.699; 2 -4.801,0; 3 -4.801,-4.699; 4 0,4.699; 5 0,0; 6 0,-4.699; 7 4.801,4.699; 8 4.801,0; 9 4.801,-4.699
SOT223 = smd 1.219 x 2.235: 1 -2.311,-3.099; 2 0,-3.099; 3 2.311,-3.099 | smd 3.6 x 2.2: 4 0,3.099
DPAK = smd 1.6 x 3: 1 -2.28,-5.31; 3 2.28,-5.31 | smd 4.826 x 5.715: 4 0,1.588
SOIC127P600X175-8N = smd 1.981 x 0.533: 1 -2.464,1.905; 2 -2.464,0.635; 3 -2.464,-0.635; 4 -2.464,-1.905; 5 2.464,-1.905; 6 2.464,-0.635; 7 2.464,0.635; 8 2.464,1.905

### Placement (x,y rotation side)
+5V  76.2,92.71 0 top
+9V  67.31,92.71 0 top
AAO_0,1  46.99,134.62 270 top
ACTV_REC  27.94,-1.27 180 top
AUDIO  153.67,134.62 270 top
BAI_0,1  66.04,134.62 270 top
BAI_2,3  85.09,134.62 270 top
BAO_0,1  27.94,134.62 270 top
BAT1  127,116.84 90 top
BUCKPUCK1  39.37,49.53 180 top
BUCKPUCK2  82.55,49.53 180 top
BUCKPUCK3  127,49.53 180 top
C1  60.96,55.88 0 top
C2  104.14,55.88 0 top
C3  151.13,55.88 0 top
C4  153.03,109.22 90 top
C5  158.75,97.79 180 top
C6  59.44,77.47 180 top
C7  98.3,76.96 180 top
C8  95.5,95.5 0 top
C9  57.4,95.25 0 top
CAMERA  46.99,5.08 90 top
CH1  156.21,3.81 0 top
CH2  165.1,3.81 0 top
CH3  173.99,3.81 0 top
D1  168.91,118.75 0 top
D2  172.72,20.32 270 top
D3  172.72,31.11 270 top
D_FREE1_2  66.04,5.08 90 top
D_FREE3_4  85.09,5.08 90 top
DGND  167.64,68.58 0 top
DGND1  76.2,80.01 0 top
DNP1  59.18,84.07 270 top
DNP2  97.28,85.34 270 top
GND-ISO  67.31,80.01 0 top
HYST_L  56.9,107.95 180 top
HYST_R  95,107.95 180 top
ISOLATED  182.88,49.53 270 top
J1  187.96,20.95 90 top
J2  187.96,32.38 90 top
JP1  121.92,135.89 270 top
JP2  135.89,135.89 270 top
JP3  16.51,98.42 270 top
JP4  16.51,41.27 270 top
JP5  180.34,33.53 90 top
JP6  180.34,22.61 90 top
JP10  171.45,143.51 180 top
LED_CUE_3  191.77,68.58 270 top
LED_MASK_1,2  185.42,88.9 180 top
LICK  123.19,5.08 90 top
LICK_INPUTS  104.14,134.62 270 top
MXP-A  5.08,41.27 90 top
MXP-B  5.08,98.42 90 top
OK1  50.8,80.01 270 top
OK2  88.9,80.01 270 top
POWER_LED  182.88,123.19 0 top
Q1  57.15,46.99 90 top
Q2  64.14,42.55 90 top
Q3  101.6,46.99 90 top
Q4  109.22,41.91 90 top
Q5  147.32,46.99 90 top
Q6  144.78,39.37 0 top
R1  153.67,31.75 0 top
R2  153.67,20.32 0 top
R3  154.94,36.83 270 top
R4  154.94,25.4 270 top
R5  168.91,123.19 180 top
R6  62.23,46.99 270 top
R7  106.68,46.99 270 top
R8  152.4,46.99 270 top
R9  58.42,42.55 270 top
R10  102.87,41.91 270 top
R11  147.32,41.91 180 top
R12  69.85,42.55 90 top
R13  114.3,41.91 90 top
R14  140.34,37.47 270 top
R15  46.48,90.42 180 top
R16  84.58,90.42 180 top
R17  47.5,99.57 180 top
R18  85.6,99.57 180 top
R19  55.37,99.57 180 top
R20  93.47,99.57 180 top
R21  59.44,80.01 0 top
R22  98.3,80.01 0 top
R23  178.05,58.04 180 top
S1  182.88,110.49 270 top
S2  167,46.99 270 top
SHUTTER  104.14,5.08 90 top
SLN  142.24,5.08 90 top
T1  163.83,17.78 270 top
T2  163.83,29.21 270 top
TSH_L  40.64,107.95 180 top
TSH_R  78.74,107.95 180 top
U1  160.66,109.86 0 top
U2  50.8,95.25 0 top
U3  88.9,95.25 0 top
VIN  154.94,68.58 0 top
VSOLN  161.29,68.58 0 top

### Tracks (layer width: path | path; a pad name or v marks a point on that pad's centre or on a via)
+5V  (via drill 0.6)
  Top 0.406: JP4.1 MXP-A.1
  Top 0.61: v38.73,67.94 v31.11,67.94 | v128.27,66.04 133.35,60.96 v147.32,60.96 | v160.02,60.96 162.56,60.96 167,56.52 S2.2 | v60.2,87.88 59.18,86.87 DNP1.1 | v98.55,88.65 97.28,87.38 DNP2.1
  Bottom 0.61: v31.11,67.94 19.68,67.94 15.24,63.5 JP4.1 | v128.27,66.04 125.73,68.58 91.44,68.58 | 91.44,68.58 50.8,68.58 | 50.8,68.58 39.37,68.58 v38.73,67.94 | v160.02,60.96 v147.32,60.96 | v60.2,87.88 50.8,78.49 50.8,68.58 | v98.55,88.65 96.01,86.11 91.44,86.11 | 91.44,86.11 82.8,86.11 +5V.TP | 91.44,86.11 91.44,68.58
+9V  (via drill 0.6)
  Bottom 0.61: 162.31,39.65 158.47,39.65 127,71.12 v114.3,71.12 | S2.1 174.27,51.79 176.53,49.53 176.53,43.18 173,39.65 162.31,39.65 | S2.9 162.31,39.65
  pour Top (isolate 0.61): 31.75,109.22 38.1,115.57 116.84,115.57 116.84,66.04 31.75,66.04
A_+3.3V
  Top 0.406: JP4.33 MXP-A.33
A_AGND
  Top 0.406: JP4.6 16.51,57.78 5.08,57.78 MXP-A.6
A_AI0
  Top 0.61: JP4.3 MXP-A.3
A_AI1
  Top 0.61: JP4.5 MXP-A.5
A_AI2
  Top 0.61: JP4.7 MXP-A.7
A_AI3
  Top 0.61: JP4.9 MXP-A.9
A_AO0
  Top 0.61: MXP-A.2 3.81,63.5 5.08,64.77 17.78,64.77 | 17.78,64.77 JP4.2 | 17.78,64.77 22.86,64.77 29.21,71.12 29.21,115.57 41.91,128.27 AAO_0,1.P$SIG0
A_AO1  (via drill 0.6)
  Top 0.406: MXP-A.4 5.08,60.33 16.51,60.33 JP4.4
  Top 0.61: JP4.4 19.68,59.05 30.48,69.85 30.48,109.22 v43.18,121.92
  Bottom 0.406: AAO_0,1.P$SIG1 v43.18,121.92
A_DIO0
  Top 0.61: JP4.11 MXP-A.11
  Bottom 0.406: MXP-A.11 7.62,48.9 8.89,47.62 8.89,12.7 11.43,10.16 ACTV_REC.P$SIG
A_DIO1
  Top 0.61: JP4.13 MXP-A.13
  Bottom 0.406: JP4.13 13.97,46.35 10.16,42.55 10.16,13.97 11.43,12.7 35.56,12.7 36.83,11.43 CAMERA.P$SIG0
A_DIO2  (via drill 0.6)
  Top 0.406: v55.88,60.96 60.29,65.37 C6.1 60.39,77.57 R21.2
  Top 0.61: JP4.15 MXP-A.15
  Bottom 0.406: JP4.15 16.51,42.55 20.32,42.55 21.59,41.27 21.59,35.56 23.5,33.66 55.88,33.66 | 55.88,33.66 94.61,33.66 116.84,11.43 LICK.P$SIG0 | v55.88,60.96 55.88,33.66
A_DIO3
  Top 0.406: SLN.P$SIG0 144.78,11.43 152.4,19.05 152.4,20.19 R2.1
  Top 0.61: JP4.17 MXP-A.17
  Bottom 0.406: JP4.17 13.97,41.27 13.34,40.64 13.34,19.68 15.24,17.78 69.85,17.78 78.74,8.89 139.7,8.89 SLN.P$SIG0
A_DIO4  (via drill 0.36, 0.6)
  Top 0.406: JP4.19 16.51,40.01 20.95,40.01 v25.4,35.56 34.29,26.67 v111.76,26.67 | v68.33,63.5 74.68,69.85 96.52,69.85 99.15,72.48 C7.1 99.25,77.06 R22.2
  Top 0.61: JP4.19 MXP-A.19
  Bottom 0.406: v25.4,35.56 25.4,57.15 31.75,63.5 v68.33,63.5 | v111.76,26.67 123.19,15.24 LICK.P$SIG1
A_DIO5
  Top 0.406: 142.24,25.4 31.75,25.4 19.68,37.47 16.51,37.47 JP4.21 | 142.24,25.4 SLN.P$SIG1 | 142.24,25.4 145.92,25.4 R1.1
  Top 0.61: JP4.21 MXP-A.21
A_DIO6
  Top 0.406: JP4.23 16.51,32.38 19.68,32.38 27.94,24.13 88.9,24.13 101.6,11.43 SHUTTER.P$SIG0
  Top 0.61: JP4.23 MXP-A.23
A_DIO7
  Top 0.61: JP4.25 MXP-A.25
  Bottom 0.406: JP4.25 16.51,32.38 91.44,32.38 104.14,19.68 SHUTTER.P$SIG1
A_DIO8
  Top 0.406: JP4.27 16.51,27.3 22.23,27.3 27.94,21.59 39.37,21.59 CAMERA.P$SIG1
  Top 0.61: JP4.27 MXP-A.27
A_DIO9
  Top 0.61: JP4.29 MXP-A.29
A_DIO10
  Top 0.61: JP4.31 MXP-A.31
  Bottom 0.406: MXP-A.31 5.08,22.23 5.08,13.97 10.79,8.26 62.87,8.26 D_FREE1_2.P$SIG0
A_DIO11  (via drill 0.6)
  Top 0.406: MXP-A.18 5.08,42.55 16.51,42.55 JP4.18 22.23,41.27 35.56,27.94 65.66,27.94 v66.04,28.32 | v66.04,22.23 D_FREE1_2.P$SIG1
  Bottom 0.406: v66.04,28.32 v66.04,22.23
A_DIO12
  Top 0.406: MXP-A.22 5.08,34.92 16.51,34.92 JP4.22
A_DIO13  (via drill 0.6)
  Top 0.406: MXP-A.26 5.08,29.84 16.51,29.84 JP4.26 | v76.2,22.23 v76.2,16.51
  Bottom 0.406: v76.2,16.51 76.2,13.97 78.74,11.43 D_FREE3_4.P$SIG0 | v76.2,22.23 67.31,31.11 JP4.26
A_DIO14
  Top 0.406: MXP-A.32 5.08,22.23 16.51,22.23 JP4.32
A_DIO15
  Top 0.406: MXP-A.34 5.71,19.05 16.51,19.05 17.78,20.32 JP4.34
  Bottom 0.406: JP4.34 19.68,19.05 80.01,19.05 D_FREE3_4.P$SIG1
A_UART.RX
  Top 0.406: JP4.10 16.51,52.7 5.08,52.7 MXP-A.10
A_UART.TX
  Top 0.406: JP4.14 16.51,47.62 5.08,47.62 MXP-A.14
AGND  (via drill 0.6)
  Top 0.406: MXP-B.6 5.08,114.94 16.51,114.94 JP3.6
  Top 0.61: v153.67,63.5 153.67,60.96 v156.21,58.42 | v130.81,86.36 v130.81,111.76
  Bottom 0.406: MXP-B.6 5.08,114.94 16.51,114.94 JP3.6
  Bottom 0.61: v156.21,58.42 156.21,53.34 160.15,49.4 169.29,49.4 S2.4 | v153.67,63.5 v130.81,86.36 | v130.81,111.76 130.81,120.65
  pour Top (isolate 0.61, rank 3, no thermals): 116.84,141.24 -2.54,142.24 -2.54,66.04 30.48,66.04 30.48,110.49 36.83,116.84 116.84,116.84
  pour Bottom (isolate 0.406, no thermals): -1.27,67.31 19.68,67.31 19.68,112.39 26.89,119.6 137.16,119.38 137.16,143.51 -1.27,143.51
B_+3.3V
  Top 0.406: JP3.33 MXP-B.33
B_+5V
  Top 0.406: JP3.1 MXP-B.1
B_AI0
  Top 0.61: JP3.3 MXP-B.3
  Bottom 0.406: JP3.3 16.51,117.47 16.51,121.28 25.4,130.18 64.14,130.18 BAI_0,1.P$SIG0
B_AI1
  Top 0.61: JP3.5 MXP-B.5
  Bottom 0.406: JP3.5 16.51,112.39 20.32,112.39 26.67,118.75 59.05,118.75 BAI_0,1.P$SIG1
B_AI2
  Top 0.61: JP3.7 MXP-B.7
  Bottom 0.406: JP3.7 16.51,109.86 19.68,109.86 27.3,117.47 70.48,117.47 81.28,128.27 BAI_2,3.P$SIG0
B_AI3  (via drill 0.6)
  Top 0.406: BAI_2,3.P$SIG1 v81.28,121.92
  Top 0.61: JP3.9 MXP-B.9
  Bottom 0.406: JP3.9 16.51,107.31 19.05,107.31 27.94,116.2 75.56,116.2 v81.28,121.92
B_AO0
  Top 0.61: MXP-B.2 3.81,120.65 5.08,121.92 16.51,121.92 17.78,120.65 JP3.2
  Bottom 0.406: JP3.2 17.78,120.65 25.4,128.27 BAO_0,1.P$SIG0
B_AO1  (via drill 0.6)
  Top 0.406: MXP-B.4 5.08,117.47 16.51,117.47 JP3.4
  Top 0.61: v24.13,121.92 18.41,116.2 JP3.4
  Bottom 0.406: BAO_0,1.P$SIG1 v24.13,121.92
B_DIO0
  Top 0.61: JP3.11 MXP-B.11
B_DIO1
  Top 0.61: JP3.13 MXP-B.13
B_DIO2
  Top 0.61: JP3.15 MXP-B.15
B_DIO3
  Top 0.61: JP3.17 MXP-B.17
B_DIO4
  Top 0.61: JP3.19 MXP-B.19
B_DIO5
  Top 0.61: JP3.21 MXP-B.21
B_DIO6
  Top 0.61: JP3.23 MXP-B.23
B_DIO7
  Top 0.61: JP3.25 MXP-B.25
B_DIO8
  Top 0.61: JP3.27 MXP-B.27
B_DIO9  (via drill 0.6)
  Top 0.406: v114.3,58.42 v121.92,66.04 v142.24,86.36 | LED_MASK_1,2.P$SIG0 177.8,87.63 v171.45,87.63
  Top 0.61: JP3.29 MXP-B.29 | v114.3,45.09 R13.2
  Bottom 0.406: v114.3,58.42 v114.3,45.09 | v121.92,66.04 37.47,66.04 21.59,81.92 16.51,81.92 JP3.29 | v171.45,87.63 170.18,86.36 v142.24,86.36
B_DIO10
  Top 0.61: JP3.31 MXP-B.31
B_DIO11
  Top 0.406: JP3.18 16.51,99.69 5.08,99.69 MXP-B.18
B_DIO12  (via drill 0.6)
  Top 0.406: MXP-B.22 5.08,92.08 16.51,92.08 JP3.22
  Top 0.61: v21.59,45.72 31.75,35.56 140.34,35.56 | v21.59,66.42 21.59,89.53 JP3.22 | 140.34,35.56 147.32,35.56 v152.4,40.64 | R14.2 140.34,35.56
  Bottom 0.406: v21.59,66.42 v21.59,45.72 | LED_CUE_3.P$SIG 180.34,43.18 175.26,38.1 154.94,38.1 v152.4,40.64
B_DIO13
  Top 0.406: JP3.26 16.51,87 5.08,87 MXP-B.26
B_DIO14  (via drill 0.6)
  Top 0.406: MXP-B.32 5.08,79.38 16.51,79.38 JP3.32 | v147.32,88.9 v123.19,64.77 | v71.12,57.15 71.12,59.69 v73.66,62.23
  Top 0.61: v69.85,45.72 R12.2
  Bottom 0.406: JP3.32 20.95,80.64 36.83,64.77 73.66,64.77 | v123.19,64.77 73.66,64.77 | LED_MASK_1,2.P$SIG1 v147.32,88.9 | v69.85,45.72 69.85,55.88 v71.12,57.15 | 73.66,64.77 v73.66,62.23
B_DIO15
  Top 0.406: MXP-B.34 5.71,76.2 15.88,76.2 JP3.34
B_UART.RX
  Top 0.406: JP3.10 16.51,107.31 5.08,107.31 MXP-B.10
B_UART.TX
  Top 0.406: MXP-B.14 5.08,102.23 16.51,102.23 JP3.14
BCKPCK_CTRL2
  Top 0.61: R10.2 107.23,41.02 Q4.C
BCKPCK_CTRL3
  Top 0.61: Q6.C 146.22,41.91 R11.2
CTRL1
  Top 0.61: Q1.C BUCKPUCK1.CTRL
CTRL2
  Top 0.61: Q3.C BUCKPUCK2.CTRL
CTRL3
  Top 0.61: Q5.C BUCKPUCK3.CTRL
DGND  (via drill 0.6)  (5 unrouted)
  Top 0.406: MXP-A.30 5.08,24.77 16.51,24.77 | MXP-B.8 5.08,112.39 16.51,112.39 JP3.8 | MXP-A.8 5.08,55.24 16.51,55.24 JP4.8 | MXP-A.12 5.08,50.16 16.51,50.16 JP4.12 | JP3.30 16.51,84.45 | 16.51,84.45 5.08,84.45 | 5.08,84.45 MXP-B.30 | 16.51,84.45 JP3.28 19.68,87.63 19.68,88.9 JP3.24 | 5.08,84.45 MXP-B.28 | MXP-B.12 5.08,104.78 16.51,104.78 JP3.12 18.41,106.05 19.56,104.9 19.56,102.11 18.41,100.97 JP3.16 | JP3.20 16.51,94.61 5.08,94.61 MXP-B.20 | 55.79,73.75 v55.88,73.66 55.88,77.03 OK1.4 C6.2 | OK2.4 93.73,77.29 | OK2.4 96.94,77.47 C7.2 | OK2.4 93.55,75.77 91.44,73.66 v87.63,73.66
  Top 0.61: v64.77,73.66 64.77,62.23
  Bottom 0.406: JP3.12 18.92,106.05 19.56,105.41 19.56,95.76 | 19.56,95.76 19.56,90.68 | 19.56,90.68 19.56,84.07 18.67,83.19 JP3.30 | JP3.24 19.43,90.81 19.56,90.68 | JP3.20 19.43,95.89 19.56,95.76
  Bottom 0.61: v55.88,73.66 v64.77,73.66 76.2,73.66 | 76.2,73.66 v87.63,73.66 | DGND1.TP 76.2,73.66
  other vias: 164.47,23.5 166.37,23.5 168.28,23.5
  pour Bottom (isolate 0.406, rank 2): -1.27,-1.27 191.77,-1.27 191.77,143.51 138.43,143.51 138.43,116.84 118.11,116.84 118.11,66.04 -1.27,66.04
  pour Top (isolate 0.61, rank 2, no thermals): -2.54,-3.81 -2.54,64.77 118.11,64.77 118.11,140.97 191.77,140.97 191.77,-3.81
GND-ISO  (via drill 0.6)
  Top 0.406: U2.2 U2.1 47.12,97.16 46.48,97.79 46.48,99.5 R17.2 44.96,99.57 v44.7,99.31 | OK1.2 v43.94,80.01 | v82.8,99.31 83.06,99.57 R18.2 84.58,99.5 84.58,97.54 84.96,97.16 U3.1 U3.2 | OK2.2 v82.04,80.01 | C9.2 58.42,95.08 v58.42,92.96 | C8.2 96.52,95.34 v96.52,92.96
  Top 0.61: LICK_INPUTS.P$GND0 v101.6,119.38
  Bottom 0.61: 115.57,73.66 127,73.66 156.08,44.58 164.59,44.58 S2.5 | LICK_INPUTS.P$GND1 106.68,116.84 | v101.6,119.38 101.6,116.84
  Bottom 1.016: BAT1.- 116.84,116.84
  pour Bottom (isolate 0.406): 116.84,66.04 20.95,66.04 20.95,107.95 31.11,118.11 116.84,118.11
LED1+  (via drill 0.6)
  Top 0.61: BUCKPUCK1.LED+ 53.34,41.91 57.15,38.1 v66.04,38.1
  Bottom 0.61: v66.04,38.1 67.31,36.83 135.89,36.83 158.75,13.97 CH1.P1
LED2+
  Bottom 0.61: BUCKPUCK2.LED+ 95.25,38.1 137.16,38.1 167.64,7.62 CH2.P1
LED3+
  Bottom 0.61: CH3.P1 176.53,7.62 142.24,41.91 BUCKPUCK3.LED+
LICK_L_IN  (via drill 0.36)
  Top 0.406: v44.2,92.96 44.58,93.34 U2.4 48.34,91.33 R15.1
  Bottom 0.406: v44.2,92.96 47.88,92.96 69.22,114.3 87.63,114.3 101.6,128.27 LICK_INPUTS.P$SIG0
LICK_R_IN  (via drill 0.36)
  Top 0.406: R16.1 86.44,91.33 U3.4 84.71,93.34 v84.33,92.96
  Bottom 0.406: LICK_INPUTS.P$SIG1 85.09,106.68 85.09,93.73 v84.33,92.96
N$2
  Top 0.61: R3.2 154.94,31.88 155,31.82 | R1.2 155,31.82 | T2.1 160.44,31.82 155,31.82
N$3
  Top 0.61: AUDIO.P$GND0 151.13,125.09 152.4,123.83 154.94,123.83 156.21,125.09 AUDIO.P$GND1
  Bottom 0.61: JP1.SLEEVE 124.46,133.35 135.89,133.35 | 135.89,133.35 143.51,133.35 AUDIO.P$GND0 | JP2.SLEEVE 135.89,133.35
N$4
  Top 0.61: JP1.RING 126.92,129.62 128.27,128.27 140.97,128.27 | AUDIO.P$SIG0 140.97,128.27 | JP2.RING 140.89,128.35 140.97,128.27
N$5
  Top 0.61: JP1.TIP 116.92,132.16 118.11,133.35 129.54,133.35 130.81,132.08 130.81,130.97 JP2.TIP
  Bottom 0.61: JP2.TIP 137.96,123.83 152.4,123.83 153.67,125.09 AUDIO.P$SIG1
N$6
  Top 0.61: T1.1 155.07,20.09 R2.2 154.94,20.32 R4.2
N$11
  Top 0.61: BUCKPUCK3.REF 146.83,49.53 Q5.E 152.34,47.94 R8.1
N$13
  Top 0.61: POWER_LED.A R5.1
N$15
  Top 0.61: R8.2 152.34,46.04 Q5.B 148.42,41.7 R11.1
N$16
  Top 0.61: C1.+ 58.42,52.07 | C2.+ 101.6,52.07 | VIN.TP 151.13,68.58
  Top 1.016: BUCKPUCK1.VIN+ 58.42,52.07 80.7,52.07 82.35,50.42 87.83,50.42 89.48,52.07 BUCKPUCK2.VIN+ 101.6,52.07 125.15,52.07 126.8,50.42 132.28,50.42 133.93,52.07 BUCKPUCK3.VIN+ 144.78,52.07 C3.+ 151.13,58.42 151.13,68.58 151.13,102.23 153.03,104.14 | U1.1 157.97,104.14 153.03,104.14 | C4.+ 153.03,104.14
  Bottom 1.016: D1.C 163.83,118.11 153.67,107.95 C4.+
N$20  (via drill 0.6)
  Top 0.61: v154.94,92.71 158.24,89.41 158.24,46.48 160.12,44.6 164.59,44.6 S2.8
  Bottom 1.016: BAT1.+ 139.7,111.76 139.7,107.95 v154.94,92.71
N$21
  Top 0.61: R23.1 183.13,51.05 ISOLATED.A
N$22
  Top 0.61: BUCKPUCK1.REF 56.66,49.53 Q1.E 62.17,47.94 R6.1
N$23
  Top 0.406: TSH_R.S 78.74,99.06 83.19,94.61 U3.3
N$24
  Top 0.61: BUCKPUCK2.REF 101.11,49.53 Q3.E 106.62,47.94 R7.1
N$25
  Bottom 0.61: S2.3 168.55,58.04 R23.2
N$26  (via drill 0.36)
  Top 0.406: R19.1 v57.91,99.57 | v46.23,84.84 46.23,82.62 OK1.1
  Bottom 0.406: v57.91,99.57 46.23,87.88 v46.23,84.84
N$27
  Top 0.61: R14.1 140.42,38.27 Q6.B
N$28
  Top 0.61: R13.1 110.38,41.02 Q4.B
N$29
  Top 0.61: R6.2 62.17,46.04 Q1.B 58.25,43.6 R9.1
N$30
  Top 0.61: R12.1 65.3,41.66 Q2.B
N$31
  Top 0.406: U2.8 53.26,98.41 R19.2
N$32  (via drill 1)
  Top 1.016: JP6.2 184.15,22.61 | 184.15,22.61 187.58,22.61 J1.1 | v184.15,25.4 184.15,22.61
N$33
  Top 0.61: R7.2 106.62,46.04 Q3.B 102.7,42.97 R10.1
N$36
  Top 1.016: JP10.PWR 170.18,128.54 170.18,118.11 S1.2
N$37  (via drill 1)
  Top 1.016: JP5.2 183.9,33.53 | 183.9,33.53 187.83,33.53 J2.1 | v184.02,36.2 184.02,33.66 183.9,33.53
N$38
  Top 0.406: OK1.5 R21.1 58.49,82.43 DNP1.2
N$39
  Top 0.406: HYST_L.A HYST_L.S 51.31,99.82 51.31,95.38 52.07,94.61 U2.6
N$40
  Top 0.406: U2.5 51.44,93.34 50.29,94.49 50.29,99.57 | R17.1 50.29,99.57 | HYST_L.E 50.29,103.89 50.29,99.57
N$42
  Top 0.61: R9.2 62.15,41.66 Q2.C
N$46  (via drill 0.36)
  Top 0.406: OK2.1 84.25,84.25 88.14,88.14 v88.9,88.14 | v98.04,99.57 R20.1
  Bottom 0.406: v88.9,88.14 88.9,90.42 v98.04,99.57
N$47
  Top 0.406: U3.8 91.36,98.41 R20.2
N$48
  Top 0.406: U2.3 45.34,94.61 40.64,99.31 TSH_L.S
N$49
  Top 0.406: OK2.5 93.8,80.26 97.28,80.26 | 97.28,80.26 R22.1 | DNP2.2 97.28,80.26
N$50
  Top 0.406: U3.6 89.79,94.61 89.41,95 89.41,99.82 HYST_R.S HYST_R.A
N$51
  Top 0.406: U3.5 89.53,93.34 88.39,94.49 88.39,99.57 | HYST_R.E 88.39,103.89 88.39,99.57 | R18.1 88.39,99.57
VCC  (via drill 1)
  Top 0.61: 163.19,97.79 C5.+ | R5.2 166.37,120.65 166.37,105.41 165.1,104.14 163.19,104.14
  Top 1.016: v163.19,80.01 163.19,97.79 163.19,104.14 163.19,104.28 U1.3 | VSOLN.TP 167.64,62.23 173.99,62.23 177.8,58.42 177.8,37.47 v176.53,36.2 176.53,33.53 | JP5.1 176.53,33.53 | 176.53,33.53 172.93,33.53 D3.C | JP6.1 176.53,22.61 | 176.53,22.61 172.81,22.61 D2.C | v176.53,25.4 176.53,22.61
  Bottom 1.016: v176.53,36.2 v176.53,25.4 | v163.19,80.01 161.29,78.11 VSOLN.TP
VIN
  Top 1.016: S1.1 177.55,115.19 D1.A
VOUT-1
  Top 1.016: J1.2 186.4,18.12 D2.A 167.64,18.12 | 167.64,18.12 166.93,18.12 T1.4 | 167.64,18.12 167.3,17.78 T1.2
VOUT-2
  Top 1.016: J2.2 186.69,31.11 184.47,28.89 184.44,28.91 D3.A 172.43,29.21 T2.4 T2.2

### Text on the board
tPlace: GND | 5V | AO0 | Lower=Left | Upper=Right | AI0 | AO1 | AI1 | AGND | AI2 | AI3 | UART.RX | DIO0 | DIO1 | UART.TX | DIO2 | DIO3 | DIO11 | DIO4 | DIO5 | DIO12 | DIO6 | DIO7 | DIO13 | DIO8 | DIO9 | DIO10 | DIO14 | 3.3V | DIO15 | HMS Inst Core / NI MyRIO Expansion G2c / PVG 2/2020 | 5V | AO0 | AI0 | AO1 | AI1 | AGND | AI2 | AI3 | UART.RX | DIO0 | DIO1 | UART.TX | DIO2 | DIO3 | DIO11 | DIO4 | DIO5 | DIO12 | + | DIO6 | DIO7 | DIO13 | Lower=Left | Upper=Right | DIO8 | DIO9 | + | DIO10 | DIO14 | 3.3V | DIO15 | A_DIO1 / A_DIO8 | A_DIO10 / A_DIO11 | A_DIO13 / A_DIO15 | A_DIO6 / A_DIO7 | A_DIO4 / A_DIO2 | A_DIO3 / A_DIO5 | A_DIO0 | LED 1 | + | LED 2 | + | LED 3 | +
tNames: + | + | 5V Soln